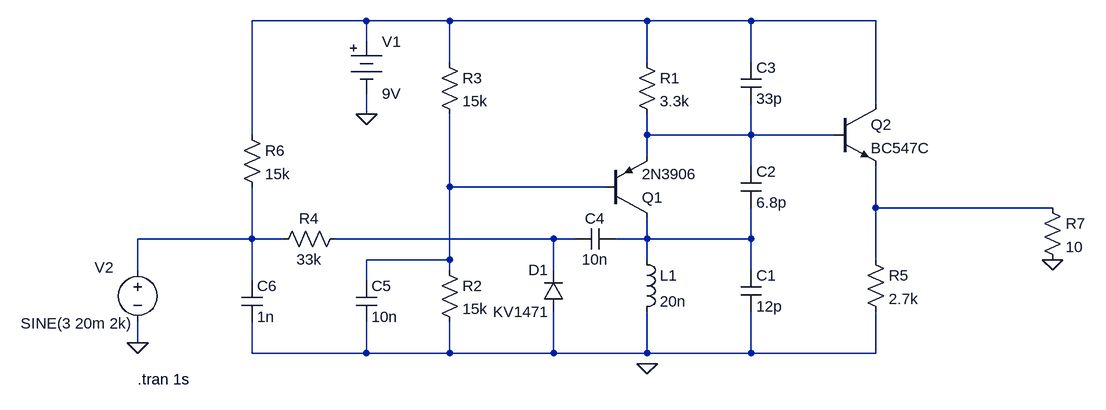
[diagram p0: schematic Draft1.asc]
Draft1.asc, the LTspice schematic file:
Version 4.1
SHEET 1 880 680
WIRE -288 -304 -464 -304
WIRE -160 -304 -288 -304
WIRE 144 -304 -160 -304
WIRE 304 -304 144 -304
WIRE 496 -304 304 -304
WIRE -288 -272 -288 -304
WIRE -160 -240 -160 -304
WIRE 144 -240 144 -304
WIRE 304 -240 304 -304
WIRE 496 -176 496 -304
WIRE -288 -160 -288 -192
WIRE -464 -128 -464 -304
WIRE 144 -128 144 -160
WIRE 304 -128 304 -176
WIRE 304 -128 144 -128
WIRE 432 -128 304 -128
WIRE 144 -96 144 -128
WIRE 304 -80 304 -128
WIRE -160 -48 -160 -160
WIRE 80 -48 -160 -48
WIRE 496 -16 496 -80
WIRE 768 -16 496 -16
WIRE -464 32 -464 -48
WIRE -464 32 -640 32
WIRE -416 32 -464 32
WIRE 0 32 -336 32
WIRE 32 32 0 32
WIRE 144 32 144 0
WIRE 144 32 96 32
WIRE 304 32 304 -16
WIRE 304 32 144 32
WIRE -160 64 -160 -48
WIRE -160 64 -288 64
WIRE 144 64 144 32
WIRE 496 64 496 -16
WIRE -640 80 -640 32
WIRE -160 80 -160 64
WIRE 0 80 0 32
WIRE 304 80 304 32
WIRE -464 96 -464 32
WIRE -288 96 -288 64
WIRE -640 192 -640 160
WIRE -464 208 -464 160
WIRE -288 208 -288 160
WIRE -288 208 -464 208
WIRE -160 208 -160 160
WIRE -160 208 -288 208
WIRE 0 208 0 144
WIRE 0 208 -160 208
WIRE 144 208 144 144
WIRE 144 208 0 208
WIRE 304 208 304 144
WIRE 304 208 144 208
WIRE 496 208 496 144
WIRE 496 208 304 208
FLAG 144 224 0
FLAG -288 -160 0
FLAG -640 192 0
FLAG 768 64 0
SYMBOL pnp 80 0 M180
SYMATTR InstName Q1
SYMATTR Value 2N3906
SYMBOL ind 128 48 R0
SYMATTR InstName L1
SYMATTR Value 20n
SYMATTR SpiceLine Rser=1m
SYMBOL cap 288 80 R0
SYMATTR InstName C1
SYMATTR Value 12p
SYMBOL cap 288 -80 R0
SYMATTR InstName C2
SYMATTR Value 6.8p
SYMBOL cap 288 -240 R0
SYMATTR InstName C3
SYMATTR Value 33p
SYMBOL res 128 -256 R0
SYMATTR InstName R1
SYMATTR Value 3.3k
SYMBOL diode 16 144 R180
WINDOW 0 24 64 Left 2
WINDOW 3 24 0 Left 2
SYMATTR InstName D1
SYMATTR Value KV1471
SYMATTR Type diode
SYMBOL cap 96 16 R90
WINDOW 0 0 32 VBottom 2
WINDOW 3 32 32 VTop 2
SYMATTR InstName C4
SYMATTR Value 10n
SYMBOL res -176 64 R0
SYMATTR InstName R2
SYMATTR Value 15k
SYMBOL res -176 -256 R0
SYMATTR InstName R3
SYMATTR Value 15k
SYMBOL cap -304 96 R0
SYMATTR InstName C5
SYMATTR Value 10n
SYMBOL res -320 16 R90
WINDOW 0 0 56 VBottom 2
WINDOW 3 32 56 VTop 2
SYMATTR InstName R4
SYMATTR Value 33k
SYMBOL Misc\\battery -288 -288 R0
WINDOW 123 0 0 Left 0
WINDOW 39 0 0 Left 0
SYMATTR InstName V1
SYMATTR Value 9V
SYMBOL voltage -640 64 R0
WINDOW 0 -66 12 Left 2
WINDOW 3 -180 98 Left 2
WINDOW 123 0 0 Left 0
WINDOW 39 0 0 Left 0
SYMATTR InstName V2
SYMATTR Value SINE(3 20m 2k)
SYMBOL res -480 -144 R0
SYMATTR InstName R6
SYMATTR Value 15k
SYMBOL cap -480 96 R0
SYMATTR InstName C6
SYMATTR Value 1n
SYMBOL npn 432 -176 R0
SYMATTR InstName Q2
SYMATTR Value BC547C
SYMBOL res 480 48 R0
SYMATTR InstName R5
SYMATTR Value 2.7k
SYMBOL res 752 -32 R0
SYMATTR InstName R7
SYMATTR Value 10
TEXT -640 248 Left 2 !.tran 1s

The netlist it stands for:
* Draft1.asc
Q1 N007 N003 N002 0 2N3906
L1 N007 N008 20n Rser=1m
C1 N007 N008 12p
C2 N002 N007 6.8p
C3 N001 N002 33p
R1 N001 N002 3.3k
D1 N008 N006 KV1471
C4 N007 N006 10n
R2 N003 N008 15k
R3 N001 N003 15k
C5 N003 N008 10n
R4 N006 N005 33k
V1 N001 0 9V
V2 N005 0 SINE(3 20m 2k)
R6 N001 N005 15k
C6 N005 N008 1n
Q2 N001 N002 N004 0 BC547C
R5 N004 N008 2.7k
R7 N004 0 10
.model D D
.lib standard.dio
.model NPN NPN
.model PNP PNP
.lib standard.bjt
.tran 1s
.backanno
.end